# Altium schematic sheet [02] Schematic.SchDoc
size B
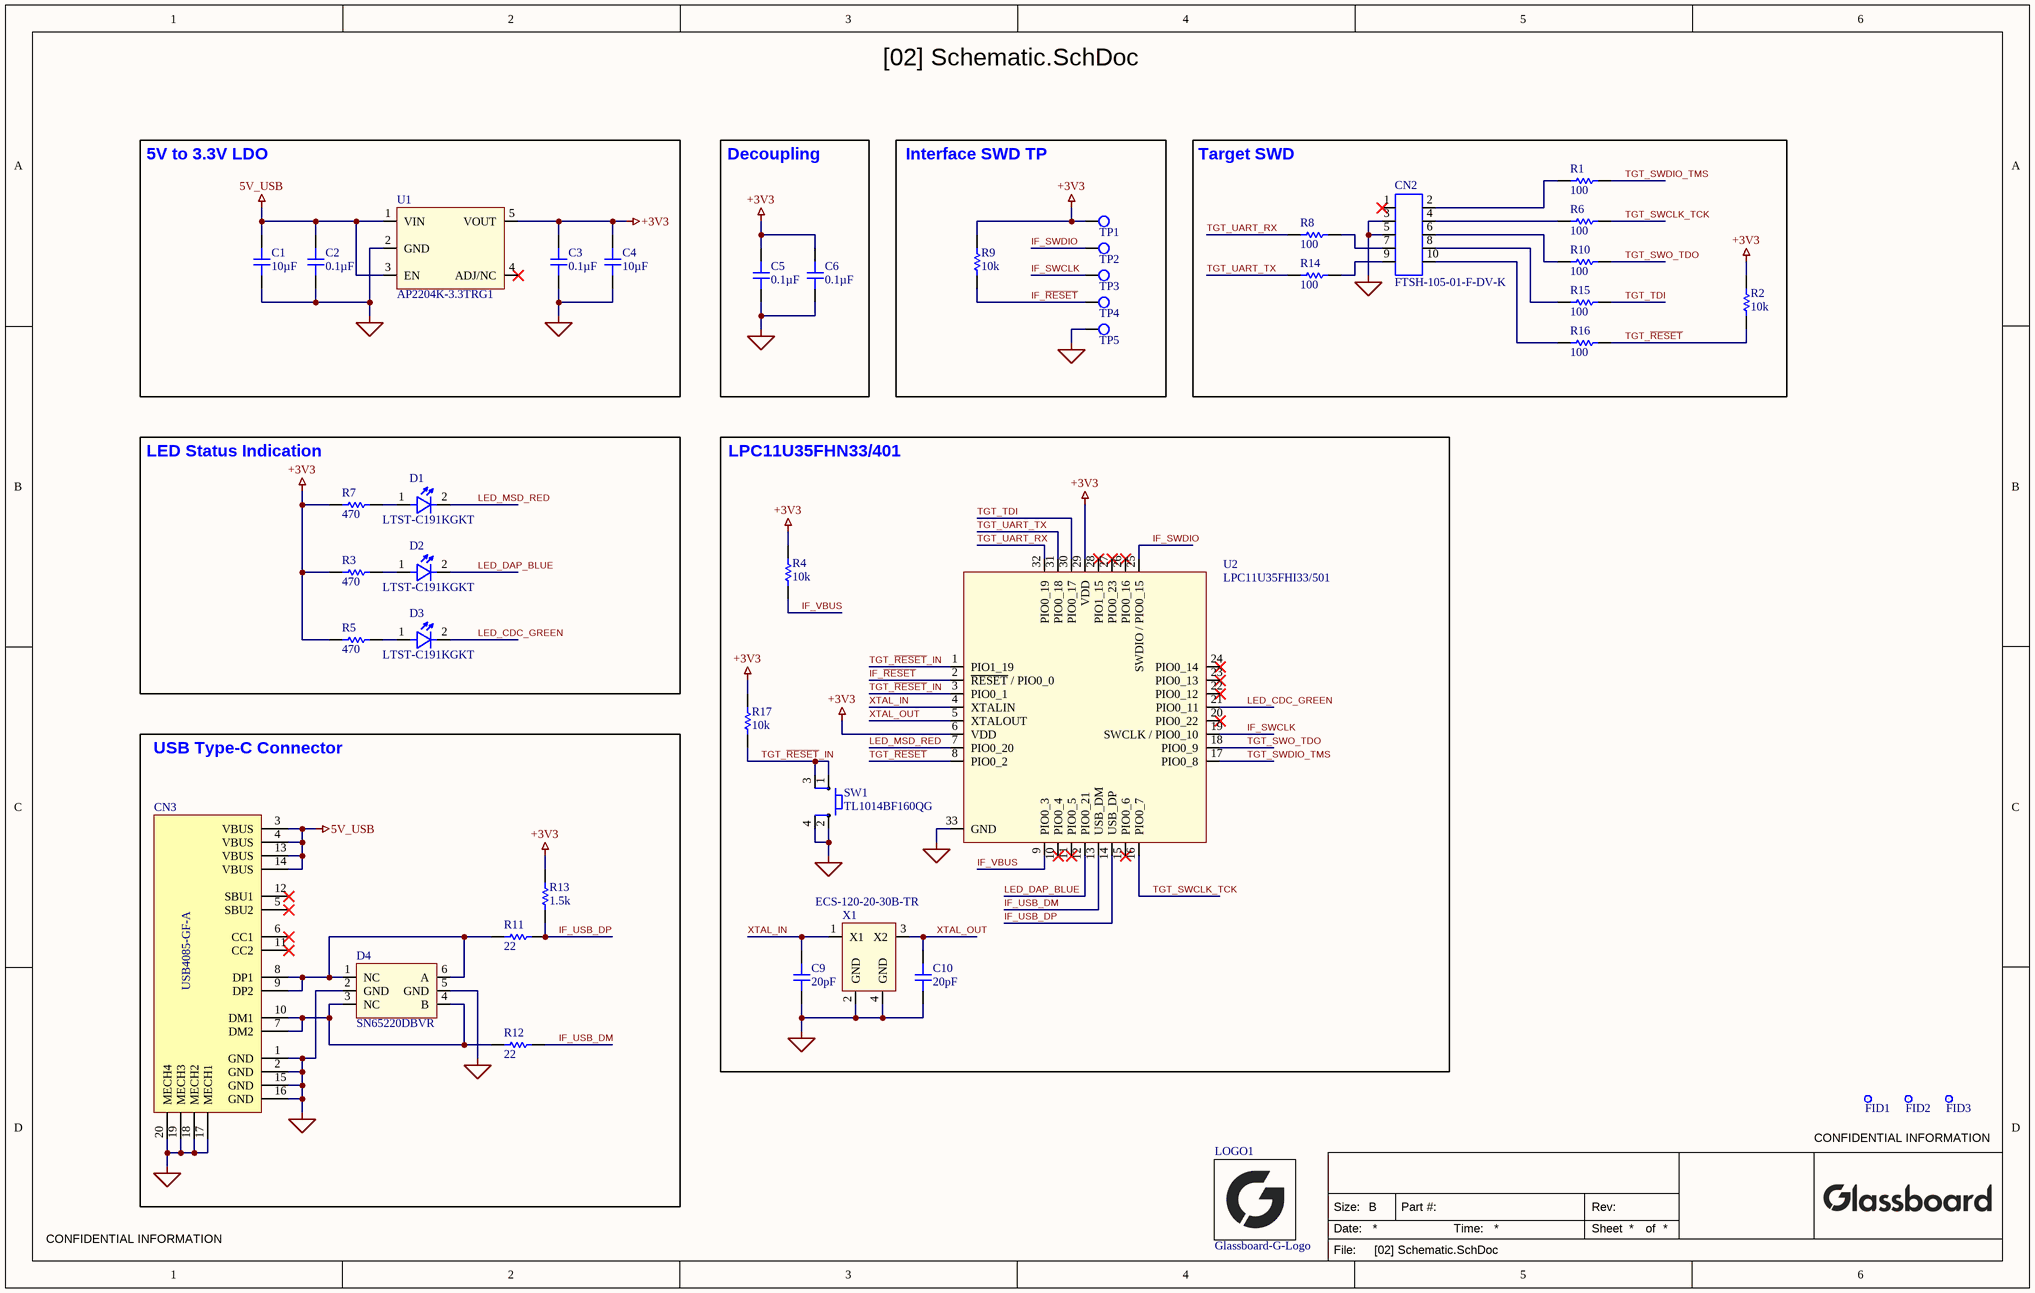
[diagram p0: [02] Schematic.SchDoc]

## Parts
C1  10µF  [CAPC0402(1005)70_L]
C2  0.1µF  [CAPC0402(1005)70_L]
C3  0.1µF  [CAPC0402(1005)70_L]
C4  10µF  [CAPC0402(1005)70_L]
C5  0.1µF  [CAPC0402(1005)70_L]
C6  0.1µF  [CAPC0402(1005)70_L]
C9  20pF  [CAPC0402(1005)70_L]
C10  20pF  [CAPC0402(1005)70_L]
CN2  FTSH-105-01-F-DV-K  [FTSH-105-01-F-DV-K]
CN3  USB4085-GF-A  [USB4085-GF-A]
D1  LTST-C191KGKT  [LTST-C191KGKT]
D2  LTST-C191KGKT  [LTST-C191KGKT]
D3  LTST-C191KGKT  [LTST-C191KGKT]
D4  SN65220DBVR  [SN65220DBVR-L]
FID1  FID  [fid_30mil]  (value not drawn)  (no BOM)
FID2  FID  [fid_30mil]  (value not drawn)  (no BOM)
FID3  FID  [fid_30mil]  (value not drawn)  (no BOM)
LOGO1  Glassboard-G-Logo  [GLASSBOARD-G-5X5MM]  (no BOM)
R1  100  [RESC0402(1005)_L]
R2  10k  [RESC0402(1005)_L]
R3  470  [RESC0402(1005)_L]
R4  10k  [RESC0402(1005)_L]
R5  470  [RESC0402(1005)_L]
R6  100  [RESC0402(1005)_L]
R7  470  [RESC0402(1005)_L]
R8  100  [RESC0402(1005)_L]
R9  10k  [RESC0402(1005)_L]
R10  100  [RESC0402(1005)_L]
R11  22  [RESC0402(1005)_L]
R12  22  [RESC0402(1005)_L]
R13  1.5k  [RESC0402(1005)_L]
R14  100  [RESC0402(1005)_L]
R15  100  [RESC0402(1005)_L]
R16  100  [RESC0402(1005)_L]
R17  10k  [RESC0402(1005)_L]
SW1  TL1014BF160QG  [TL1014BF160QG]
TP1  TESTFIXTURE_16MM  [TESTFIXTURE_16MM]  (value not drawn)
TP2  TESTFIXTURE_16MM  [TESTFIXTURE_16MM]  (value not drawn)
TP3  TESTFIXTURE_16MM  [TESTFIXTURE_16MM]  (value not drawn)
TP4  TESTFIXTURE_16MM  [TESTFIXTURE_16MM]  (value not drawn)
TP5  TESTFIXTURE_16MM  [TESTFIXTURE_16MM]  (value not drawn)
U1  AP2204K-3.3TRG1  [AP2204K-3.3TRG1_L]
U2  LPC11U35FHI33/501  [LPC11U35FHI33/501]
X1  ECS-120-20-30B-TR  [DFN370P500X85-4N]

## Blocks framed on the sheet
5V to 3.3V LDO: C1-C4 U1
Decoupling: C5 C6
Interface SWD TP: R9 TP1-TP5
Target SWD: CN2 R1 R2 R6 R8 R10 R14-R16
LED Status Indication: D1-D3 R3 R5 R7
LPC11U35FHN33/401: C9 C10 R4 R17 SW1 U2 X1
USB Type-C Connector: CN3 D4 R11-R13

## Nets
5V_USB: C1.2 C2.2 CN3.3(VBUS) CN3.4(VBUS) CN3.13(VBUS) CN3.14(VBUS) U1.1(VIN) U1.3(EN)
+3V3: C3.2 C4.2 C5.2 C6.2 R2.2 R3.1 R4.2 R5.1 R7.1 R9.2 R13.2 R17.2 TP1.1 U1.5(VOUT) U2.6(VDD) U2.29(VDD)
GND: C1.1 C2.1 C3.1 C4.1 C5.1 C6.1 C9.2 C10.2 CN2.3 CN2.5 CN3.1(GND) CN3.2(GND) CN3.15(GND) CN3.16(GND) CN3.17(MECH1) CN3.18(MECH2) CN3.19(MECH3) CN3.20(MECH4) D4.2(GND) D4.5(GND) SW1.2 SW1.4 TP5.1 U1.2(GND) U2.33(GND) X1.2(GND) X1.4(GND)
IF_~{RESET}: R9.1 TP4.1 U2.2(~{RESET}_/_PIO0_0)
IF_SWCLK: TP3.1 U2.19(SWCLK_/_PIO0_10)
IF_SWDIO: TP2.1 U2.25(SWDIO_/_PIO0_15)
IF_USB_DM: R12.2 U2.13(USB_DM)
IF_USB_DP: R11.2 R13.1 U2.14(USB_DP)
IF_VBUS: R4.1 U2.9(PIO0_3)
LED_CDC_GREEN: D3.2 U2.21(PIO0_11)
LED_DAP_BLUE: D2.2 U2.12(PIO0_21)
LED_MSD_RED: D1.2 U2.7(PIO0_20)
TGT_~{RESET}: R2.1 R16.2 U2.8(PIO0_2)
TGT_~{RESET}_IN: R17.1 SW1.1 SW1.3 U2.1(PIO1_19) U2.3(PIO0_1)
TGT_SWCLK_TCK: R6.2 U2.16(PIO0_7)
TGT_SWDIO_TMS: R1.2 U2.17(PIO0_8)
TGT_SWO_TDO: R10.2 U2.18(PIO0_9)
TGT_TDI: R15.2 U2.30(PIO0_17)
TGT_UART_RX: R8.1 U2.32(PIO0_19)
TGT_UART_TX: R14.1 U2.31(PIO0_18)
XTAL_IN: C9.1 U2.4(XTALIN) X1.1(X1)
XTAL_OUT: C10.1 U2.5(XTALOUT) X1.3(X2)
NetCN2_2: CN2.2 R1.1
NetCN2_4: CN2.4 R6.1
NetCN2_6: CN2.6 R10.1
NetCN2_7: CN2.7 R8.2
NetCN2_8: CN2.8 R15.1
NetCN2_9: CN2.9 R14.2
NetCN2_10: CN2.10 R16.1
NetCN3_7: CN3.7(DM2) CN3.10(DM1) D4.3(NC) D4.4(B) R12.1
NetCN3_8: CN3.8(DP1) CN3.9(DP2) D4.1(NC) D4.6(A) R11.1
NetD1_1: D1.1 R7.2
NetD2_1: D2.1 R3.2
NetD3_1: D3.1 R5.2

Not connected (* = marked no-connect by the designer): CN2 1*; CN3 5(SBU2)* 6(CC1)* 11(CC2)* 12(SBU1)*; FID1 0; FID2 0; FID3 0; U1 4(ADJ/NC)*; U2 10(PIO0_4)* 11(PIO0_5)* 15(PIO0_6)* 20(PIO0_22)* 22(PIO0_12)* 23(PIO0_13)* 24(PIO0_14)* 26(PIO0_16)* 27(PIO0_23)* 28(PIO1_15)*

## Notes on the sheet
- CONFIDENTIAL INFORMATION
- Size:
- Date:
- B
- Part #:
- Time:
- Rev:
- Sheet
- of
- File:

## Library data of the parts
C1 C4 = CC0402MRX5R5BB106: CAP CER 10UF 6.3V X5R 0402; Manufacturer: Yageo; Tolerance: 0.2; ESD: NO; Part Number: CC0402MRX5R5BB106; Status: Active; Component Type: CAP - CHIP; Value: 10µF; Wattage: N/A; Voltage: 6.3V; Package Type: SMD; Package: CAP0402; Manufacturer Part Number: CC0402MRX5R5BB106; Distributor 1: Digi-Key; Distributor 1 Part Number: 311-1729-1-ND; DNP: *; Moisture Sensitivity: NO; Pin Count: 2; Published: 9/8/2017; Publisher: Randy Parmerlee
C2 C3 C5 C6 = CGA2B2X5R1A104M050BA: CAP CER 0.1UF 10V X5R 0402; Manufacturer: TDK Corporation; Tolerance: 0.2; ESD: NO; Part Number: CGA2B2X5R1A104M050BA; Status: Active; Component Type: CAP - CHIP; Value: 0.1µF; Wattage: N/A; Voltage: 10V; Package Type: SMD; Package: CAP0402; Manufacturer Part Number: CGA2B2X5R1A104M050BA; Distributor 1: Digi-Key; Distributor 1 Part Number: 445-12157-1-ND; DNP: *; Moisture Sensitivity: NO; Pin Count: 2; Published: 12/9/2015; Publisher: Drew Westrick
C9 C10 = CC0402JRNPO9BN200: CAP CER 20PF 50V C0G/NPO 0402; Manufacturer: Yageo; Tolerance: 0.05; ESD: NO; Part Number: CC0402JRNPO9BN200; Status: Active; Component Type: CAP - CHIP; Value: 20pF; Wattage: N/A; Voltage: 50V; Package Type: SMD; Package: CAP0402; Manufacturer Part Number: CC0402JRNPO9BN200; Distributor 1: Digi-Key; Distributor 1 Part Number: 311-1417-1-ND; DNP: *; Moisture Sensitivity: NO; Pin Count: 2; Published: 9/8/2017; Publisher: Randy Parmerlee
CN2 = FTSH-105-01-F-DV-K: CONN HEADER 10POS DUAL .05" SMD; Manufacturer: Samtec Inc; ESD: NO; Part Number: FTSH-105-01-F-DV-K; Status: Active; Component Type: CONN - SMD; Value: FTSH-105-01-F-DV-K; Voltage: N/A; Current: N/A; Package Type: SMD; Manufacturer Part Number: FTSH-105-01-F-DV-K; Distributor 1: Digi-Key; Distributor 1 Part Number: SAM8796-ND; DNP: *; Moisture Sensitivity: NO; Pin Count: 10; Published: 10/4/2016; Publisher: Drew Westrick
CN3 = USB4085-GF-A: CONN RCPT USB2.0 TYPEC 16POS; Manufacturer: GCT; ESD: NO; Part Number: USB4085-GF-A; Status: Active; Component Type: CONN - PTH; Value: USB4085-GF-A; Voltage: N/A; Current: N/A; Package Type: PTH; Manufacturer Part Number: USB4085-GF-A; Distributor 1: Digi-Key; Distributor 1 Part Number: 2073-USB4085-GF-ACT-ND; DNP: *; Moisture Sensitivity: NO; Pin Count: 20; Published: 12/8/2020; Publisher: Stephen Murphy
D1-D3 = LTST-C191KGKT: LED GREEN CLEAR THIN 0603 SMD; Manufacturer: Lite-On Inc; ESD: YES; Part Number: LTST-C191KGKT; Status: Active; Component Type: LED - SMD; Value: LTST-C191KGKT; Tolerance: N/A; Wattage: N/A; Voltage: N/A; Package Type: SMD; Package: LED0603; Manufacturer Part Number: LTST-C191KGKT; Distributor 1: Digi-Key; Distributor 1 Part Number: 160-1446-1-ND; DNP: *; Moisture Sensitivity: YES; Pin Count: 2; Published: 8/25/2015; Publisher: Randy Parmerlee
D4 = SN65220DBVR: IC SINGLE USB PORT TVS SOT-23-6; Manufacturer: Texas Instruments; Voltage: 5V; ESD: YES; Part Number: SN65220DBVR; Status: Active; Component Type: DIO - SMD; Value: SN65220DBVR; Tolerance: N/A; Current: N/A; Package Type: SMD; Package: SOT-23-6; Manufacturer Part Number: SN65220DBVR; Distributor 1: Digi-Key; Distributor 1 Part Number: 296-9694-1-ND; DNP: *; Moisture Sensitivity: YES; Pin Count: 6; Published: 5/9/2016; Publisher: Randy Parmerlee
FID1-FID3 = Fiducial: Surface Mount Fiducials; ESD: NO; Part Number: Fiducial; Status: Active; Component Type: FID - SMD; Value: FID; Voltage: N/A; Current: N/A; Package Type: N/A; Manufacturer: N/A; Manufacturer Part Number: N/A; Distributor 1: N/A; Distributor 1 Part Number: N/A; DNP: *; Moisture Sensitivity: NO; Pin Count: 1; Published: 11/19/2015; Publisher: Randy Parmerlee
LOGO1 = Glassboard-G-Logo-5x5MM: Glassboard Company Logo 5x5mm; Part Number: Glassboard-G-Logo-5x5MM; Status: Active; Published: 12/10/2020; Publisher: Stephen Murphy
R1 R6 R8 R10 R14-R16 = RC0402FR-07100RL: RES SMD 100 OHM 1% 1/16W 0402; Manufacturer: Yageo; Tolerance: 0.01; Wattage: 0.063W; ESD: NO; Part Number: RC0402FR-07100RL; Status: Active; Component Type: RES - CHIP; Value: 100; Voltage: N/A; Package Type: SMD; Package: RES0402; Manufacturer Part Number: RC0402FR-07100RL; Distributor 1: Digi-Key; Distributor 1 Part Number: 311-100LRCT-ND; DNP: *; Moisture Sensitivity: NO; Pin Count: 2; Published: 9/6/2017; Publisher: Randy Parmerlee
R2 R4 R9 R17 = RC0402FR-0710KL: RES SMD 10K OHM 1% 1/16W 0402; Manufacturer: Yageo; Tolerance: 0.01; Wattage: 0.063W; ESD: NO; Part Number: RC0402FR-0710KL; Status: Active; Component Type: RES - CHIP; Value: 10k; Voltage: N/A; Package Type: SMD; Package: RES0402; Manufacturer Part Number: RC0402FR-0710KL; Distributor 1: Digi-Key; Distributor 1 Part Number: 311-10.0KLRCT-ND; DNP: *; Moisture Sensitivity: NO; Pin Count: 2; Published: 9/6/2017; Publisher: Randy Parmerlee
R3 R5 R7 = ERJ-2RKF4700X: RES SMD 470 OHM 1% 1/10W 0402; Manufacturer: Panasonic Electronic Components; Tolerance: 0.01; Wattage: 0.1W; ESD: NO; Part Number: ERJ-2RKF4700X; Status: Not For Use; Component Type: RES - CHIP; Value: 470; Voltage: N/A; Package Type: SMD; Package: RES0402; Manufacturer Part Number: ERJ-2RKF4700X; Distributor 1: Digi-Key; Distributor 1 Part Number: P470LCT-ND; DNP: *; Moisture Sensitivity: NO; Pin Count: 2; Published: 12/9/2015; Publisher: Drew Westrick
R11 R12 = RC0402FR-0722RL: RES SMD 22 OHM 1% 1/16W 0402; Manufacturer: Yageo; Tolerance: 0.01; Wattage: 0.063W; ESD: NO; Part Number: RC0402FR-0722RL; Status: Active; Component Type: RES - CHIP; Value: 22; Voltage: N/A; Package Type: SMD; Package: RES0402; Manufacturer Part Number: RC0402FR-0722RL; Distributor 1: Digi-Key; Distributor 1 Part Number: 311-22.0LRCT-ND; DNP: *; Moisture Sensitivity: NO; Pin Count: 2; Published: 9/6/2017; Publisher: Randy Parmerlee
R13 = ERJ-2RKF1501X: RES SMD 1.5K OHM 1% 1/10W 0402; Manufacturer: Panasonic Electronic Components; Tolerance: 0.01; Wattage: 0.1W; ESD: NO; Part Number: ERJ-2RKF1501X; Status: Not For Use; Component Type: RES - CHIP; Value: 1.5k; Voltage: N/A; Package Type: SMD; Package: RES0402; Manufacturer Part Number: ERJ-2RKF1501X; Distributor 1: Digi-Key; Distributor 1 Part Number: P1.50KLCT-ND; DNP: *; Moisture Sensitivity: NO; Pin Count: 2; Published: 12/9/2015; Publisher: Drew Westrick
SW1 = TL1014BF160QG: SWITCH TACTILE SPST-NO 0.05A 12V; Manufacturer: E-Switch; ESD: NO; Part Number: TL1014BF160QG; Status: Active; Component Type: SWITCH - SMD; Value: TL1014BF160QG; Voltage: N/A; Current: 0.05A; Package Type: SMD; Package: Gull Wing; Manufacturer Part Number: TL1014BF160QG; Distributor 1: Digi-Key; Distributor 1 Part Number: EG5042CT-ND; DNP: *; Moisture Sensitivity: NO; Pin Count: 4; Published: 10/8/2018; Publisher: Randy Parmerlee
TP1-TP5 = TESTFIXTURE_16MM: TEST POINT ROUND 1.6mm; Manufacturer: GlassBoard; Part Number: TESTFIXTURE_16MM; Status: Actiive; Component Type: TP - SMD; Value: TESTFIXTURE_16MM; Current: N/A; Voltage: N/A; Package Type: SMD; Package: TP16MMSMD; Manufacturer Part Number: TESTFIXTURE_16MM; Distributor 1: GlassBoard; Distributor 1 Part Number: N/A; DNP: *; Pin Count: 1; Published: 12/8/2020; Publisher: Ethan Harmon
U1 = AP2204K-3.3TRG1: IC REG LDO 3.3V 0.15A SOT25; Manufacturer: Diodes Incorporated; Voltage: 24V; ESD: YES; Part Number: AP2204K-3.3TRG1; Status: Active; Component Type: IC - LDO; Value: AP2204K-3.3TRG1; Package Type: SMD; Package: SOT-23-5; Manufacturer Part Number: AP2204K-3.3TRG1; Distributor 1: Digi-Key; Distributor 1 Part Number: AP2204K-3.3TRG1DITR-ND; DNP: *; Moisture Sensitivity: YES; Pin Count: 5; Published: 6/14/2017; Publisher: Randy Parmerlee
U2 = LPC11U35FHI33/501: IC MCU 32BIT 64KB FLASH 32HVQFN; Manufacturer: NXP USA Inc.; Voltage: 3.3V; ESD: YES; Part Number: LPC11U35FHI33/501; Status: Active; Component Type: IC - MICRO; Value: LPC11U35FHI33/501; Package Type: SMD; Package: HVQFN-33; Manufacturer Part Number: LPC11U35FHI33/501; Distributor 1: Mouser; DNP: *; Moisture Sensitivity: YES; Pin Count: 32; Published: 5/20/2021; Publisher: Stephen Murphy
X1 = ECS-120-20-30B-TR: Crystal 12.0000MHz 30ppm 20pF 80 Ohm -20°C - 70°C Surface Mount 4-SMD, No Lead (DFN, LCC); Manufacturer: ECS Inc.; ESD: YES; Part Number: ECS-120-20-30B-TR; Status: Active; Component Type: OSC - SMD; Value: ECS-120-20-30B-TR; Voltage: N/A; Package Type: SMD; Package: SMD -DFN; Manufacturer Part Number: ECS-120-20-30B-TR; Distributor 1: Digi-Key; Distributor 1 Part Number: XC1118CT-ND; DNP: *; Moisture Sensitivity: YES; Pin Count: 4; Published: 8/23/2015; Publisher: Randy Parmerlee